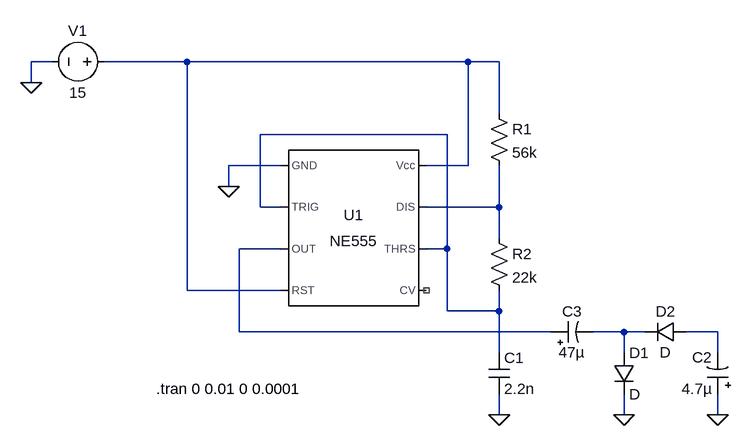
[diagram p0: schematic 555timer_voltageInerter_ChargePump.asc]
555timer_voltageInerter_ChargePump.asc, the LTspice schematic file:
Version 4
SHEET 1 880 680
WIRE -352 -96 -384 -96
WIRE -144 -96 -272 -96
WIRE 288 -96 -144 -96
WIRE 336 -96 288 -96
WIRE -384 -64 -384 -96
WIRE 336 -16 336 -96
WIRE 256 16 -32 16
WIRE 0 64 -80 64
WIRE 288 64 288 -96
WIRE 288 64 224 64
WIRE -80 96 -80 64
WIRE -32 128 -32 16
WIRE 0 128 -32 128
WIRE 336 128 336 64
WIRE 336 128 224 128
WIRE 336 176 336 128
WIRE 0 192 -64 192
WIRE 256 192 256 16
WIRE 256 192 224 192
WIRE -144 256 -144 -96
WIRE 0 256 -144 256
WIRE 256 288 256 192
WIRE 336 288 336 256
WIRE 336 288 256 288
WIRE -64 320 -64 192
WIRE 416 320 -64 320
WIRE 528 320 480 320
WIRE 560 320 528 320
WIRE 672 320 624 320
WIRE 336 352 336 288
WIRE 528 352 528 320
WIRE 672 352 672 320
WIRE 336 448 336 416
WIRE 528 448 528 416
WIRE 672 448 672 416
FLAG -80 96 0
FLAG -384 -64 0
FLAG 336 448 0
FLAG 528 448 0
FLAG 672 448 0
SYMBOL Misc\\NE555 112 160 R0
SYMATTR InstName U1
SYMBOL voltage -256 -96 R90
WINDOW 0 -32 56 VBottom 2
WINDOW 3 32 56 VTop 2
WINDOW 123 0 0 Left 2
WINDOW 39 0 0 Left 2
SYMATTR InstName V1
SYMATTR Value 15
SYMBOL res 320 -32 R0
SYMATTR InstName R1
SYMATTR Value 56k
SYMBOL res 320 160 R0
SYMATTR InstName R2
SYMATTR Value 22k
SYMBOL cap 320 352 R0
SYMATTR InstName C1
SYMATTR Value 2.2n
SYMBOL polcap 416 336 R270
WINDOW 0 32 32 VTop 2
WINDOW 3 0 32 VBottom 2
SYMATTR InstName C3
SYMATTR Value 47µ
SYMATTR Description Capacitor
SYMATTR Type cap
SYMATTR SpiceLine V=25 Irms=210m Rser=0.55 Lser=0
SYMBOL diode 512 352 R0
SYMATTR InstName D1
SYMBOL diode 624 304 R90
WINDOW 0 0 32 VBottom 2
WINDOW 3 32 32 VTop 2
SYMATTR InstName D2
SYMBOL polcap 688 416 R180
WINDOW 0 24 57 Left 2
WINDOW 3 24 8 Left 2
SYMATTR InstName C2
SYMATTR Value 4.7µ
SYMATTR Description Capacitor
SYMATTR Type cap
SYMATTR SpiceLine V=50 Irms=170m Rser=1 Lser=0
TEXT -192 408 Left 2 !.tran 0 0.01 0 0.0001

The netlist it stands for:
* 555timer_voltageInerter_ChargePump.asc
XU1 0 N002 N004 N001 NC_01 N002 N003 N001 NE555  ; pins GND TRIG OUT RST CV THRS DIS Vcc
V1 N001 0 15
R1 N001 N003 56k
R2 N003 N002 22k
C1 N002 0 2.2n
C3 N004 N005 47µ V=25 Irms=210m Rser=0.55 Lser=0
D1 N005 0 D
D2 N006 N005 D
C2 0 N006 4.7µ V=50 Irms=170m Rser=1 Lser=0
.model D D
.lib standard.dio
.tran 0 0.01 0 0.0001
.lib NE555.sub
.backanno
.end